# EAGLE schematic mariam test (EAGLE 9.6.2)
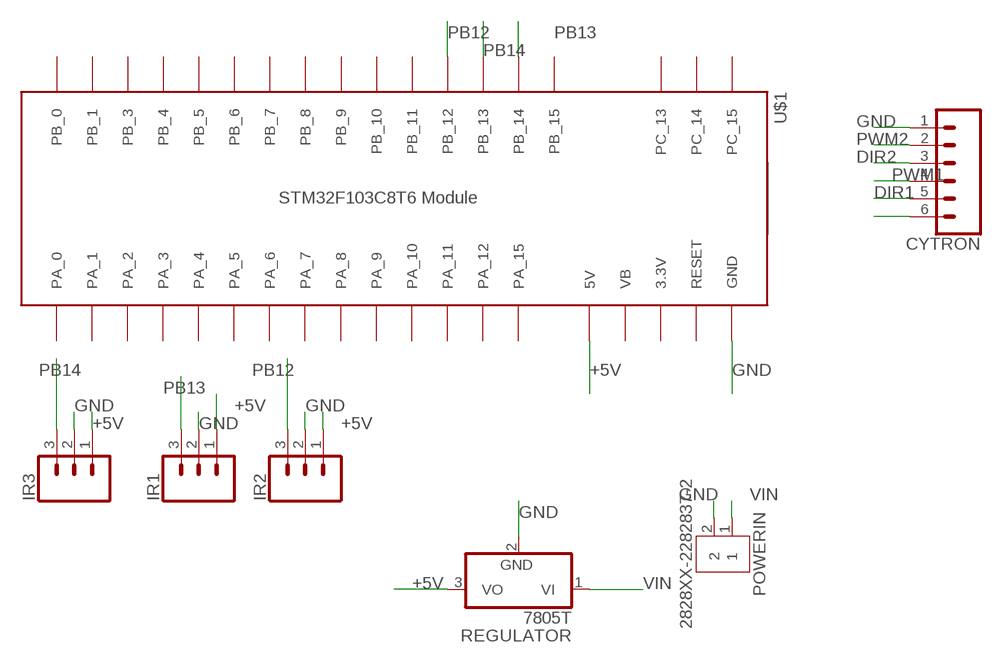
[diagram p0: schematic, sheet 1]

## Parts
CYTRON  CONN_06LONGPADS  [1X06_LONGPADS]
IR1  CONN_03LONGPADS  [1X03_LONGPADS]
IR2  CONN_03LONGPADS  [1X03_LONGPADS]
IR3  CONN_03LONGPADS  [1X03_LONGPADS]
POWERIN  2828XX-2282837-2  [TERMBLK_508-2N]
REGULATOR  7805T  [TO220H]
U$1  STM32F103C8T6-MODULE  [STM32F103C8T6-MODULE]

## Nets
+5V: IR1.1 IR2.1 IR3.1 REGULATOR.3(VO) U$1.5V
DIR1: CYTRON.5
DIR2: CYTRON.3
GND: CYTRON.1 IR1.2 IR2.2 IR3.2 POWERIN.2 REGULATOR.2(GND) U$1.GND@1(GND) U$1.GND@2(GND) U$1.GND@3(GND)
N$12: CYTRON.6
PB12: IR2.3 U$1.PB_12
PB13: IR1.3 U$1.PB_14
PB14: IR3.3 U$1.PB_13
PWM1: CYTRON.4
PWM2: CYTRON.2
VIN: POWERIN.1 REGULATOR.1(VI)
Unconnected: U$1.3.3V@1(3.3V) U$1.3.3V@2(3.3V) U$1.PA_0 U$1.PA_1 U$1.PA_2 U$1.PA_3 U$1.PA_4 U$1.PA_5 U$1.PA_6 U$1.PA_7 U$1.PA_8 U$1.PA_9 U$1.PA_10 U$1.PA_11 U$1.PA_12 U$1.PA_15 U$1.PB_0 U$1.PB_1 U$1.PB_3 U$1.PB_4 U$1.PB_5 U$1.PB_6 U$1.PB_7 U$1.PB_8 U$1.PB_9 U$1.PB_10 U$1.PB_11 U$1.PB_15 U$1.PC_13 U$1.PC_14 U$1.PC_15 U$1.RESET U$1.VB

## Library data of the parts
CYTRON = SparkFun-Connectors:CONN_06: Multi connection point. Often used as Generic Header-pin footprint for 0.1 inch spaced/style header connections On any of the 0.1 inch spaced packages, you can populate with these: Break Away Headers - Straight <https://www.sparkfun.com/products/116> (PRT-00116) Break Away Male Headers - Right Angle <https://www.sparkfun.com/products/553> (PRT-00553) Female Headers <https://www.sparkfun.com/products/115> (PRT-00115) Break Away Headers - Machine Pin <https://www.sparkfun.com/products/117> (PRT-00117) Break Away Female Headers - Swiss Machine Pin <https://www.sparkfun.com/products/743> (PRT-00743) Arduino Stackable Header - 6 Pin <https://www.sparkfun.com/products/9280> (PRT-09280) For SCREWTERMINALS and SPRING TERMINALS visit here: Screw Terimnals on SparkFun.com <https://www.sparkfun.com/search/results?term=Screw+Terminals> (5mm/3.5mm/2.54mm spacing) This device is also useful as a general connection point to wire up your design to another part of your project. Our various solder wires solder well into these plated through hole pads. Hook-Up Wire - Assortment (Stranded, 22 AWG) <https://www.sparkfun.com/products/11375> (PRT-11375) Hook-Up Wire - Assortment (Solid Core, 22 AWG) <https://www.sparkfun.com/products/11367> (PRT-11367) View the entire wire category on our website here <https://www.sparkfun.com/categories/141>
IR1-IR3 = SparkFun-Connectors:CONN_03: Multi connection point. Often used as Generic Header-pin footprint for 0.1 inch spaced/style header connections On any of the 0.1 inch spaced packages, you can populate with these: Break Away Headers - Straight <https://www.sparkfun.com/products/116> (PRT-00116) Break Away Male Headers - Right Angle <https://www.sparkfun.com/products/553> (PRT-00553) Female Headers <https://www.sparkfun.com/products/115> (PRT-00115) Break Away Headers - Machine Pin <https://www.sparkfun.com/products/117> (PRT-00117) Break Away Female Headers - Swiss Machine Pin <https://www.sparkfun.com/products/743> (PRT-00743) Stackable Header - 3 Pin (Female, 0.1") <https://www.sparkfun.com/products/13875> (PRT-13875) For SCREWTERMINALS and SPRING TERMINALS visit here: Screw Terimnals on SparkFun.com <https://www.sparkfun.com/search/results?term=Screw+Terminals> (5mm/3.5mm/2.54mm spacing) This device is also useful as a general connection point to wire up your design to another part of your project. Our various solder wires solder well into these plated through hole pads. Hook-Up Wire - Assortment (Stranded, 22 AWG) <https://www.sparkfun.com/products/11375> (PRT-11375) Hook-Up Wire - Assortment (Solid Core, 22 AWG) <https://www.sparkfun.com/products/11367> (PRT-11367) View the entire wire category on our website here <https://www.sparkfun.com/categories/141> Special notes: Molex polarized connector foot print use with SKU : PRT-08232 with associated crimp pins and housings.
POWERIN = Connector:2828XX-2: 2 Position Wire to Board Terminal Block Horizontal with Board Datasheet <https://www.te.com.cn/commerce/DocumentDelivery/DDEController?Action=showdoc&DocId=Catalog+Section%7F1308389_EUROSTYLE_TERMINAL_BLOCKS%7F0607%7Fpdf%7FEnglish%7FENG_CS_1308389_EUROSTYLE_TERMINAL_BLOCKS_0607.pdf%7F2-282837-5>; CATEGORY: Connector; DESCRIPTION: 2 Position Wire to Board Terminal Block Horizontal with Board 5.08 mm Through Hole; MANUFACTURER: TE Connectivity; MPN: 282837-2; OPERATING_TEMPERATURE: -40°C to +105°C; PART_STATUS: ACTIVE; ROHS_COMPLIANCE: RoHS Compliant; SERIES: 282837; SUBCATEGORY: Terminal Block; TYPE: Side Wire Entry
REGULATOR = linear:78*: Positive VOLTAGE REGULATOR Source: http://cache.national.com/ds/LM/LM78L05.pdf http://www.fairchildsemi.com/ds/LM/LM7805.pdf
U$1 = bluepill_eagle_lib:STM32F103C8T6-MODULE: STM32F103C8T6 module with ARM Cortex-3, 20kB SRAM, 64kB Flash, 72MHz